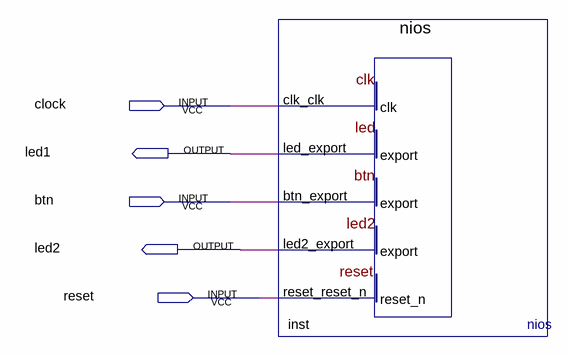
[diagram p0: schematic sheet]
// Quartus schematic SD.bdf as structural Verilog: 1 symbols, 5 pins
module SD (
  input  clock,
  input  btn,
  input  reset,
  output led1,
  output led2
);

  nios inst (.clk_clk(clock), .btn_export(btn), .reset_reset_n(reset), .led_export(led1), .led2_export(led2));
endmodule
